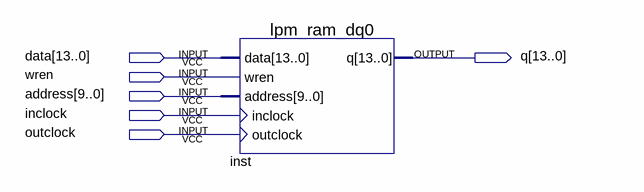
[diagram p0: schematic sheet]
// Quartus schematic Memory.bdf as structural Verilog: 1 symbols, 6 pins
module Memory (
  input  [13:0] data,
  input  wren,
  input  [9:0] address,
  input  inclock,
  input  outclock,
  output [13:0] q
);

  lpm_ram_dq0 inst (.data(data), .wren(wren), .address(address), .inclock(inclock), .outclock(outclock), .q(q));
endmodule
